# Altium schematic sheet Sheet3.SchDoc
size A; SheetNumber: 3; SheetTotal: 3
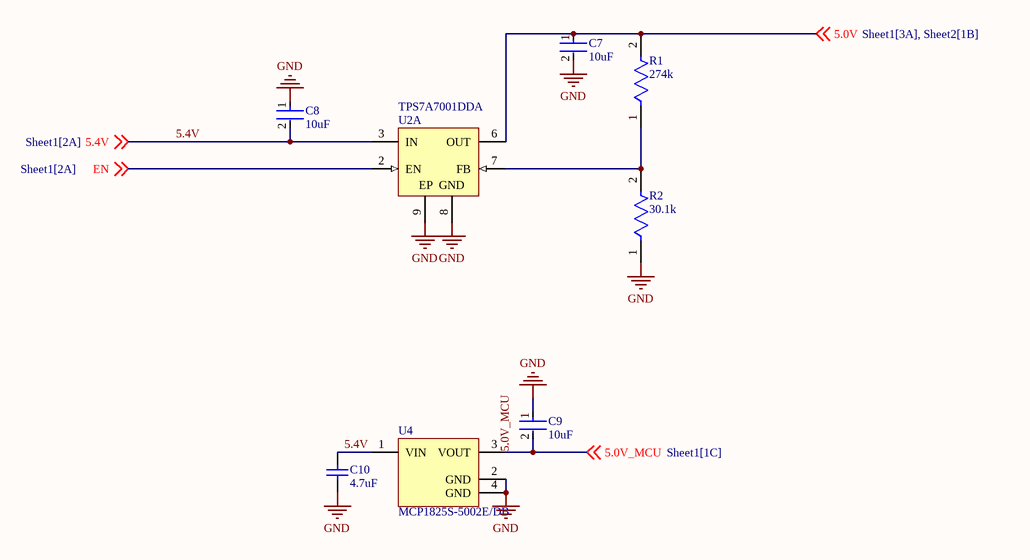
[diagram p0: Sheet3.SchDoc]

## Parts
C7  10uF  [FP-GRM21B-0_1-IPC_C]
C8  10uF  [FP-GRM21B-0_1-IPC_C]
C9  10uF  [FP-GRM21B-0_1-IPC_C]
C10  4.7uF  [CAPC2013X135X45LL10T25]
R1  274k  [FP-CRCW0805-e3-MFG]
R2  30.1k  [FP-CRCW0805-e3-MFG]
U2  TPS7A7001DDA  [DDA0008E_M]  (part A of 2)
U4  MCP1825S-5002E/DB  [SOT-223-DB3_N]

## Nets
GND: C7.2 C8.1 C9.1 C10.1 R2.1 U2.8(GND) U2.9(EP) U4.2(GND) U4.4(GND)
5.0V: C7.1 R1.2 U2.6(OUT) ; off-sheet 5.0V
5.0V_MCU: C9.2 U4.3(VOUT) ; off-sheet 5.0V_MCU
5.4V: C8.2 C10.2 U2.3(IN) U4.1(VIN) ; off-sheet 5.4V
EN: U2.2(EN) ; off-sheet EN
NetR1_1: R1.1 R2.2 U2.7(FB)

## Library data of the parts
C7-C9 = CMP-2007-03453-2: Chip Multilayer Ceramic Capacitors for General Purpose, 0805, 10uF, X5R, 15%, 10%, 16V; Radiation Hardening: No; Thickness: 0.053inch; Voltage Rating (DC): 16V; Lead Free: Lead Free; Package Quantity: 1; Width: 1.25mm; Case Code (Imperial): 0805; Depth: 1.25mm; Packaging: Tape and Reel; Dielectric: X5R; Max Operating Temperature: 85°C; Tolerance: 10%; Voltage Rating: 16V; Voltage: 16V; Capacitance: 10uF; Height: 1.25mm; Case Code (Metric): 2012; Material: Ceramic; Mount: Surface Mount; Case/Package: 0805; REACH SVHC: No SVHC; Length: 2mm; Min Operating Temperature: -55°C; Termination: SMD/SMT
C10 = CMP-1662-00015-2: Chip Capacitor, 4.7 uF, +/- 10%, 16 V, -55 to 85 degC, 0805 (2012 Metric), RoHS, Tape and Reel; PartNumber: GRM21BR61C475KA88L; Voltage Rating (DC): 16 V; Type (Capacitors): X5R; Case\/Package: 0805; Pins: 2; DatasheetVersion: 03/2016; REACH SVHC: No SVHC; Tolerance: 10%; Width: 1.25 mm; Capacitance: 4.7 uF; Mount: Surface Mount; ComponentLink1Description: Manufacturer URL; Case Code (Metric): 2012; PackageDescription: 2-Pin Surface Mount Device, Body 2 x 1.25 mm; Height: 1.25 mm; Voltage Rating: 16 V; Max Operating Temperature: 85 degC; RoHSCompliant: true; Length: 2 mm; ComponentLink1URL: http://www.murata.com/; Mounting Technology: Surface Mount; Packaging: Tape and Reel; Min Operating Temperature: -55 degC; ComponentLink2Description: Datasheet; Case Code (Imperial): 0805; Radiation Hardening: No; Package Quantity: 3000; PackageReference: 0805; ComponentLink2URL: http://search.murata.co.jp/Ceramy/image/img/A01X/G101/ENG/GRM21BR61C475KA88-01.pdf
R1 = CMP-2001-03738-2: RES Thick Film, 274kΩ, 1%, 0.125W, 100ppm/°C, 0805; Resistance: 274kR; Max Power Dissipation: 125mW; Voltage Rating: 150V; Height: 0.45mm; Lead Free: Lead Free; Width: 0.049inch; Case Code (Metric): 2012; Military Standard: Not; Packaging: Tape and Reel; Min Operating Temperature: -55°C; Termination: SMD/SMT; Contact Plating: Tin; Composition: Thick Film; Features: Automotive AEC-Q200; Radiation Hardening: No; Power Rating: 125mW; Temperature Coefficient: 100ppm/°C; Package Quantity: 10; Length: 2mm; Max Operating Temperature: 155°C; Voltage Rating (DC): 150V; Tolerance: 1%; Number of Terminations: 2; Case/Package: 0805; Case Code (Imperial): 0805; Number of Pins: 2; Depth: 1.25mm; Weight: 0.000194oz
R2 = CMP-2001-03804-2: RES Thick Film, 30kΩ, 1%, 0.125W, 100ppm/°C, 0805; Max Power Dissipation: 125mW; Voltage Rating (DC): 150V; Resistance: 30kR; Contact Plating: Tin; Weight: 0.000194oz; Temperature Coefficient: 100ppm/°C; Packaging: Tape and Reel; Height: 0.45mm; Case Code (Imperial): 0805; Max Operating Temperature: 155°C; Case/Package: 0805; Package Quantity: 10; Case Code (Metric): 2012; Features: Automotive AEC-Q200; Mount: Surface Mount; Length: 2mm; Termination: SMD/SMT; Lead Free: Lead Free; Width: 0.049inch; Number of Pins: 2; Depth: 1.25mm; Min Operating Temperature: -55°C; Power Rating: 125mW; Voltage Rating: 150V; Military Standard: Not; Composition: Thick Film; Tolerance: 1%; Number of Terminations: 2; Radiation Hardening: No
U2 = CMP-0395-00551-2: Single Output Very Low Input LDO, 2 A, Adjustable 0.9 to 5 V Output, 1.5 to 6.5 V Input, 8-pin SOPowerPAD (DDA), -40 to 125 degC, Green (RoHS & no Sb/Br); Manufacturer: Texas Instruments; Iout(Max)(A): 2; Vin(Min)(V): 1.5; Vout Adj(Min)(V): 0.9; Iq(Typ)(mA): 0.01; Vdo(Typ)(mV): 170; Vin(Max)(V): 6.5; Vout Adj(Max)(V): 5; SubFamily: Single Channel LDO; PartNumber: TPS7A7001DDA; ComponentLink3URL: http://www.ti.com/litv/pdf/mpds092e; ComponentLink3Description: Package Specification; Accuracy(%): 2; ComponentLink2URL: http://www.ti.com/general/docs/lit/getliterature.tsp?genericPartNumber=TPS7A7001&fileType=pdf; ComponentLink2Description: Datasheet; PackageReference: DDA0008E; PackageDescription: 8-Pin Plastic Small Outline, Body 3.9 x 4.9 mm, Pitch 1.27 mm; ComponentLink1URL: http://www.ti.com/; DatasheetVersion: SBVS134B; PackageVersion: 4202561/F; Mounting Technology: Surface Mount; Code_JEDEC: MS-012; ComponentLink1Description: Manufacturer URL; Eco-Plan: Green (RoHS & no Sb/Br)
U4 = CMP-0136-00456-1: 500 mA, Low Voltage, Low Quiescent Current LDO Regulator, 3-Pin SOT-223, Extended Temperature; DatasheetVersion: revB, Feb-2008; PackageVersion: revBB, Aug-2009; PackageReference: SOT-223-DB3; PackageDescription: 3-Lead Plastic Small Outline Transistor (DB) [SOT-223]